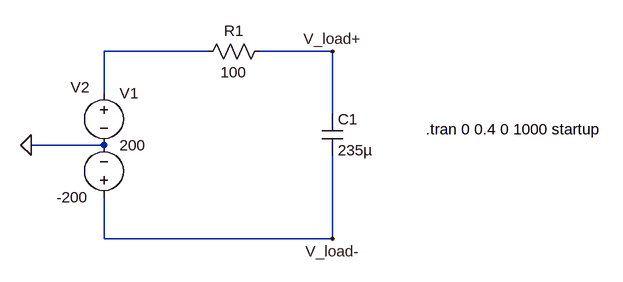
[diagram p0: schematic precharge_1_contactor.asc]
precharge_1_contactor.asc, the LTspice schematic file:
Version 4
SHEET 1 880 680
WIRE 208 48 48 48
WIRE 400 48 288 48
WIRE 48 112 48 48
WIRE 400 144 400 48
WIRE 48 192 -64 192
WIRE 48 336 48 272
WIRE 400 336 400 208
WIRE 400 336 48 336
FLAG -64 192 0
FLAG 400 48 V_load+
FLAG 400 336 V_load-
SYMBOL voltage 48 96 R0
WINDOW 123 0 0 Left 0
WINDOW 39 0 0 Left 0
SYMATTR InstName V1
SYMATTR Value 200
SYMBOL voltage 48 288 R180
WINDOW 0 22 185 Left 2
WINDOW 3 24 16 Left 2
WINDOW 123 0 0 Left 0
WINDOW 39 0 0 Left 0
SYMATTR InstName V2
SYMATTR Value -200
SYMBOL res 304 32 R90
WINDOW 0 0 56 VBottom 2
WINDOW 3 32 56 VTop 2
SYMATTR InstName R1
SYMATTR Value 100
SYMBOL cap 384 144 R0
SYMATTR InstName C1
SYMATTR Value 235µ
TEXT 544 168 Left 2 !.tran 0 0.4 0 1000 startup

The netlist it stands for:
* precharge_1_contactor.asc
V1 N001 0 200
V2 V_load- 0 -200
R1 V_load+ N001 100
C1 V_load+ V_load- 235µ
.tran 0 0.4 0 1000 startup
.backanno
.end